# Altium schematic sheet InputConnectors.SchDoc
size Letter; CompanyName: Ploopy Corporation; Organization: Ploopy Corporation; Address1: Suite 226, 137-1140 Burnhamthorpe Road W; Address2: Mississauga; Address3: Ontario; Address4: Canada L5C 0A3; DocumentNumber: 3; Revision: R1.007; SheetNumber: 3; SheetTotal: 11
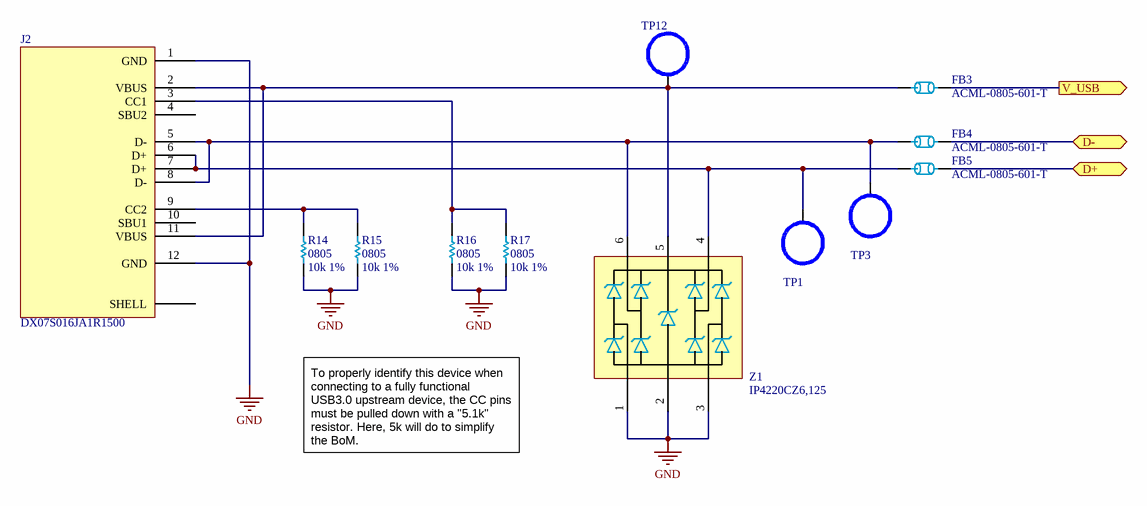
[diagram p0: InputConnectors.SchDoc]

## Parts
FB3  ACML-0805-601-T  [0805]
FB4  ACML-0805-601-T  [0805]
FB5  ACML-0805-601-T  [0805]
J2  DX07S016JA1R1500  [DX07S016JA1R1500]
R14  0805  value 10k 1%  [0805]
R15  0805  value 10k 1%  [0805]
R16  0805  value 10k 1%  [0805]
R17  0805  value 10k 1%  [0805]
TP1  TestPointHook  [S2751-46R]  (value not drawn)
TP3  TestPointHook  [S2751-46R]  (value not drawn)
TP12  TestPointHook  [S2751-46R]  (value not drawn)
Z1  IP4220CZ6,125  [PESD3V3S4UD - SOT95P275X110-6N]

## Ports
D+ (bidir), D- (bidir), V_USB (out)

## Nets
GND: J2.1(GND) J2.12(GND) R14.1 R15.1 R16.1 R17.1 Z1.1 Z1.2 Z1.3
D+: FB5.2 ; port D+
D-: FB4.2 ; port D-
V_USB: FB3.2 ; port V_USB
NetFB3_1: FB3.1 J2.2(VBUS) J2.11(VBUS) TP12.1 Z1.5
NetFB4_1: FB4.1 J2.5(D-) J2.8(D-) TP3.1 Z1.6
NetFB5_1: FB5.1 J2.6(D+) J2.7(D+) TP1.1 Z1.4
NetJ2_3: J2.3(CC1) R16.2 R17.2
NetJ2_9: J2.9(CC2) R14.2 R15.2

Not connected (* = marked no-connect by the designer): J2 4(SBU2) 10(SBU1) SHELL

## Notes on the sheet
- To properly identify this device when connecting to a fully functional USB3.0 upstream device, the CC pins must be pulled down with a "5.1k" resistor. Here, 5k will do to simplify the BoM.
- Copyright Ploopy Corporation 2023
- Licensed under the CERN-OHL-S v2
- http://ohwr.org/cernohl
- Title:
- PCB:
- Version:
- Ploopy Corporation
- Mississauga ON L5C 0A3
- 137-1140 Burnhamthorpe Road W
- Date:
- Time:
- Sheet
- of
- Canada

## Library data of the parts
FB3-FB5 = ACML-0805-601-T: FERRITE BEAD 600 OHM 0805 1LN; PNP-Nzl: 2; PNP-dx: 0; PNP-X: 2.00; PNP-Y: 1.25; PNP-Thk: 0.55; PNP-Lv: 1; PNP-TS: 70; PNP-Type: chi; PNP-FeedType: Tape; PNP-TapeWidth: 8; PNP-dy: 0; PNP-Pt: 0; PNP-W: 0; PNP-Level: 1; PNP-Voff: 0; PNP-PlacePriority: 1; PNP-A: 0; PNP-TapeIndex: 1; PNP-da: 0; Supplier 1: Digi-Key; Supplier Part Number 1: 535-12556-1-ND
J2 = DX07S016JA1R1500: USB-C (USB TYPE-C) USB 2.0 Receptacle Connector 24 (16+8 Dummy) Position Surface Mount, Right Angle; Through Hole; Supplier 1: Digi-Key; Supplier 2: Mouser; Supplier Part Number 1: 670-DX07S016JA1R1500CT-ND; Supplier Part Number 2: 656-DX07S016JA1R1500
R14-R17 = Res 10k 1% 0805: Chip resistor; Supplier 1: Digi-Key; Supplier Part Number 1: RMCF0805FT10K0TR-ND
TP1 TP3 TP12 = TestPointHook: Test point, SMT ring (micro-hook compatible); Supplier 1: Digi-Key; Supplier Part Number 1: 952-2664-6-ND; Supplier 2: Digi-Key; Supplier Part Number 2: A106144DKR-ND; Supplier 3: Arrow; Supplier Part Number 3: z_4zPAhGJpPHHYBcC24zmONEz5elv0VZALWfNkICq0w
Z1 = IP4220CZ6,125: TVS DIODE 5.5V 6TSOP (Low capacitance, USB); PNP-Nzl: 2; PNP-dx: 0; PNP-X: 2.9; PNP-Y: 1.3; PNP-A: 270; PNP-Thk: 1; PNP-Lv: 26; PNP-TS: 90; PNP-Type: CHP; PNP-FeedType: Tape; PNP-TapeWidth: 8; PNP-PlacePriority: 3; PNP-dy: 0; PNP-Pt: 0; PNP-W: 0; PNP-Level: 1; PNP-Voff: 0; PNP-TapeIndex: 1; PNP-da: 0